# EAGLE design LoraWan_shield_v01 (EAGLE 7.5.0)

## Sheet 1 of 2
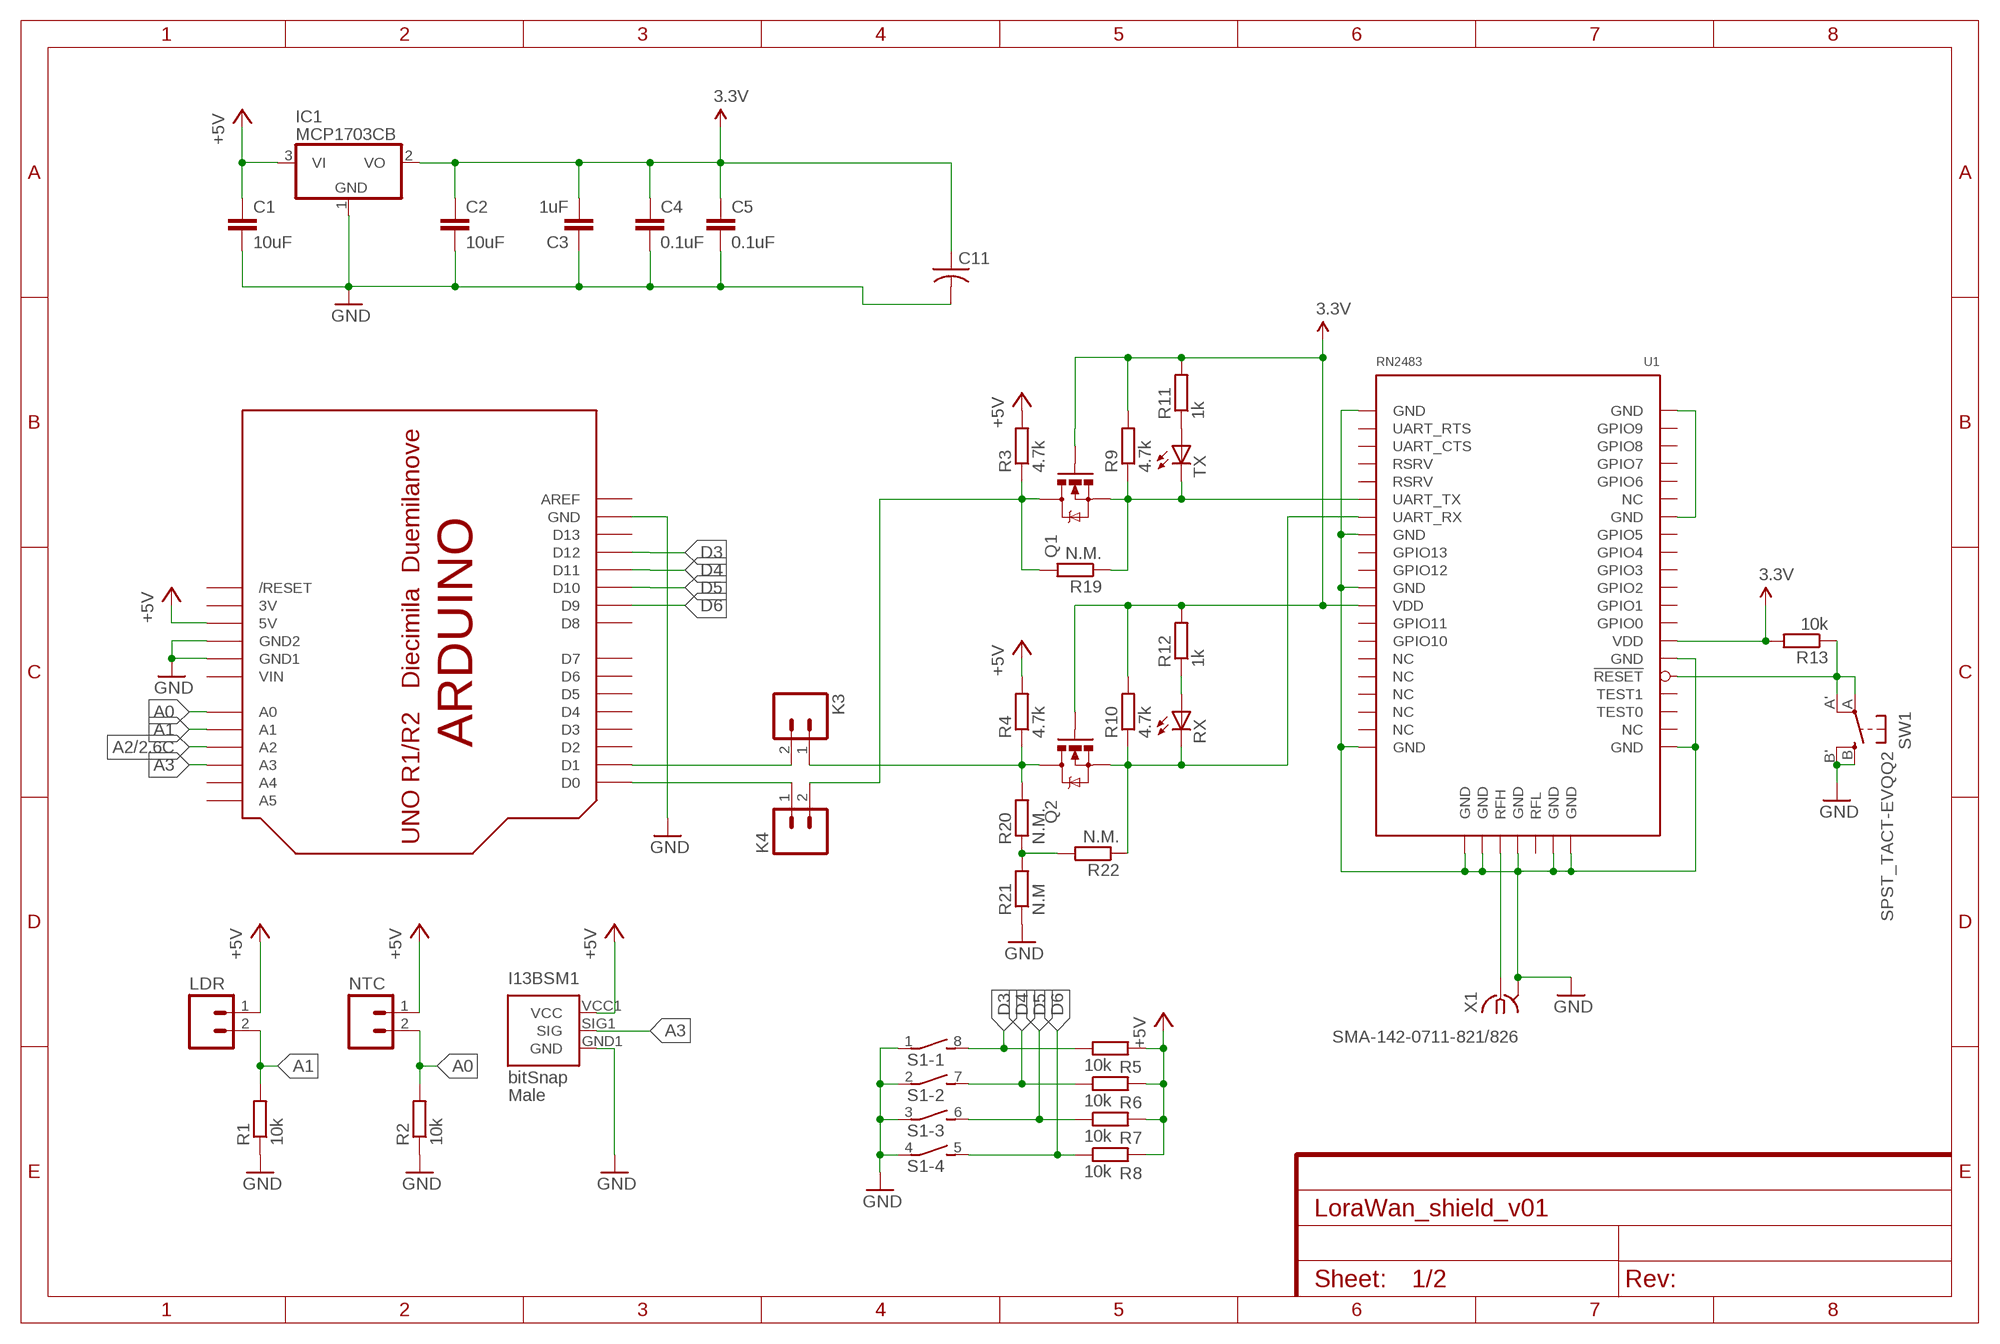
[diagram p0: schematic, sheet 1]

### Parts
ARD1  ARDUINO-NOHOLE  [ARDUINO-NOHOLE]
C1  10uF  C-EUC0603K  [C0603K]
C2  10uF  C-EUC0603K  [C0603K]
C3  1uF  C-EUC0603K  [C0603K]
C4  0.1uF  C-EUC0603K  [C0603K]
C5  0.1uF  C-EUC0603K  [C0603K]
C11  C-USC0603  [C0603]
I13BSM1  BITSNAP_V03_MALE  [BITSNAP_V03_MALE]
IC1  MCP1703CB  [SOT23]
K3  M02LOCK_LONGPADS  [1X02_LOCK_LONGPADS]
K4  M02LOCK_LONGPADS  [1X02_LOCK_LONGPADS]
LDR  M02LOCK_LONGPADS  [1X02_LOCK_LONGPADS]
NTC  M02LOCK_LONGPADS  [1X02_LOCK_LONGPADS]
Q1  DMG1012T  [SOT523]
Q2  DMG1012T  [SOT523]
R1  10k  R-EU_R0603  [R0603]
R2  10k  R-EU_R0603  [R0603]
R3  4.7k  R-EU_R0603  [R0603]
R4  4.7k  R-EU_R0603  [R0603]
R5  10k  R-EU_R0603  [R0603]
R6  10k  R-EU_R0603  [R0603]
R7  10k  R-EU_R0603  [R0603]
R8  10k  R-EU_R0603  [R0603]
R9  4.7k  R-EU_R0603  [R0603]
R10  4.7k  R-EU_R0603  [R0603]
R11  1k  R-EU_R0603  [R0603]
R12  1k  R-EU_R0603  [R0603]
R13  10k  R-EU_R0603  [R0603]
R19  N.M.  R-EU_R0603  [R0603]
R20  N.M.  R-EU_R0603  [R0603]
R21  N.M  R-EU_R0603  [R0603]
R22  N.M.  R-EU_R0603  [R0603]
RX  LEDCHIPLED_0603  [CHIPLED_0603]
S1  DIP04S  [DIP04S]
SW1  SPST_TACT-EVQQ2  [EVQ-Q2]
TX  LEDCHIPLED_0603  [CHIPLED_0603]
U1  RN2483  [RN2483]
X1  SMA-142-0711-821/826  [J502-ND-142-0711-821/826]

### Nets
3.3V: C2.1 C3.2 C4.1 C5.1 C11.1 IC1.2(VO) Q1.1(G) Q2.1(G) R9.2 R10.2 R11.2 R12.2 R13.2 U1.12(VDD) U1.34(VDD)
+5V: ARD1.5V C1.1 I13BSM1.VCC1(VCC) IC1.3(VI) LDR.1 NTC.1 R3.2 R4.2 R5.2 R6.2 R7.2 R8.2 ; also sheet 2
A0: ARD1.A0 NTC.2 R2.2
A1: ARD1.A1 LDR.2 R1.2
A2: ARD1.A2 ; also sheet 2
A3: ARD1.A3 I13BSM1.SIG1(SIG)
ARD_RX: ARD1.D1 K3.2
ARD_TX: ARD1.D0 K4.1
D3: ARD1.D12 R5.1 S1.8
D4: ARD1.D11 R6.1 S1.7
D5: ARD1.D10 R7.1 S1.6
D6: ARD1.D9 R8.1 S1.5
GND: ARD1.GND ARD1.GND1 ARD1.GND2 C1.2 C2.2 C3.1 C4.2 C5.2 C11.2 I13BSM1.GND1(GND) IC1.1(GND) R1.1 R2.1 R21.1 S1.1 S1.2 S1.3 S1.4 SW1.B'(S1) SW1.B(S) U1.1(GND) U1.8(GND) U1.11(GND) U1.20(GND) U1.21(GND) U1.22(GND) U1.24(GND) U1.26(GND) U1.27(GND) U1.28(GND) U1.33(GND) X1.G@1 X1.G@2 X1.G@3 X1.G@4 ; also sheet 2
N$1: U1.41(GND) U1.47(GND)
N$2: R13.1 SW1.A'(P1) SW1.A(P) U1.32(!RESET!)
N$3: Q1.2(S) R9.1 R19.1 TX.C U1.6(UART_TX)
N$4: K4.2 Q1.3(D) R3.1 R19.2
N$6: R11.1 TX.A
N$7: K3.1 Q2.3(D) R4.1 R20.2
N$8: R12.1 RX.A
N$9: U1.23(RFH) X1.1
N$10: Q2.2(S) R10.1 R22.1 RX.C U1.7(UART_RX)
N$11: R20.1 R21.2 R22.2
Unconnected: ARD1.A4 ARD1.A5 ARD1.AREF ARD1.D2 ARD1.D3 ARD1.D4 ARD1.D5 ARD1.D6 ARD1.D7 ARD1.D8 ARD1.D13 ARD1.RESET(/RESET) U1.2(UART_RTS) U1.3(UART_CTS) U1.4(RSRV) U1.5(RSRV) U1.9(GPIO13) U1.10(GPIO12) U1.13(GPIO11) U1.14(GPIO10) U1.15(NC) U1.16(NC) U1.17(NC) U1.18(NC) U1.19(NC) U1.25(RFL) U1.29(NC) U1.30(TEST0) U1.31(TEST1) U1.35(GPIO0) U1.36(GPIO1) U1.37(GPIO2) U1.38(GPIO3) U1.39(GPIO4) U1.40(GPIO5) U1.42(NC) U1.43(GPIO6) U1.44(GPIO7) U1.45(GPIO8) U1.46(GPIO9)

## Sheet 2 of 2: Electret Mic Amplifier
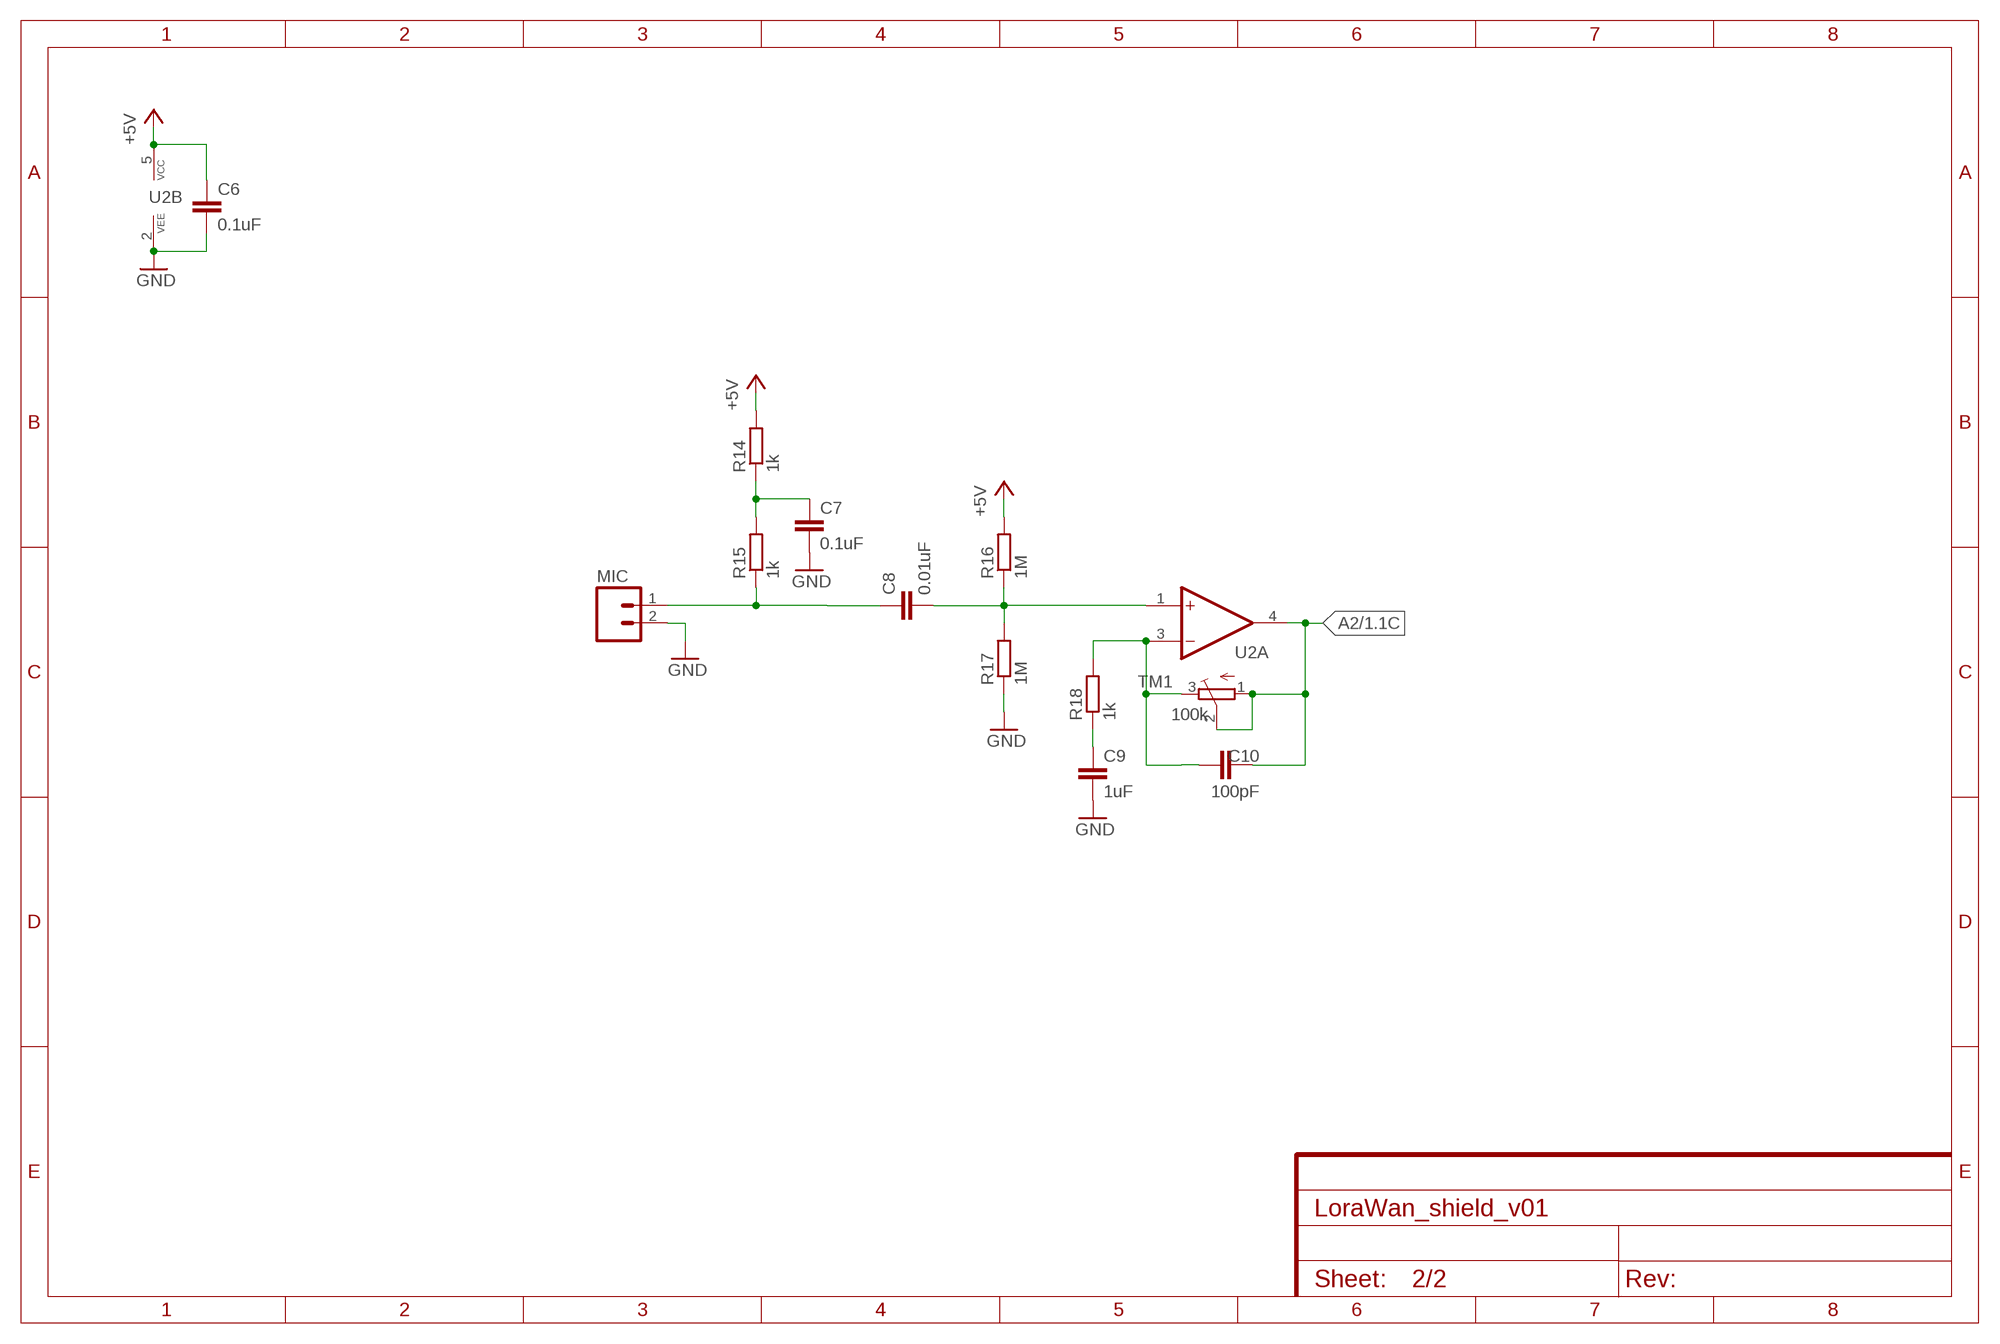
[diagram p1: schematic, sheet 2]

### Parts
C6  0.1uF  C-EUC0603K  [C0603K]
C7  0.1uF  C-EUC0603K  [C0603K]
C8  0.01uF  C-EUC0603K  [C0603K]
C9  1uF  C-EUC0603K  [C0603K]
C10  100pF  C-EUC0603K  [C0603K]
MIC  M02LOCK_LONGPADS  [1X02_LOCK_LONGPADS]
R14  1k  R-EU_R0603  [R0603]
R15  1k  R-EU_R0603  [R0603]
R16  1M  R-EU_R0603  [R0603]
R17  1M  R-EU_R0603  [R0603]
R18  1k  R-EU_R0603  [R0603]
TM1  100k  TRIMPOTTC33X  [TC33X]
U2  MAX4466EXK+T  [SC70]

### Nets
+5V: C6.1 R14.2 R16.2 U2.5(B:VCC) ; also sheet 1
A2: C10.2 TM1.1(A) TM1.2(S) U2.4(A:OUT) ; also sheet 1
GND: C6.2 C7.2 C9.2 MIC.2 R17.1 U2.2(B:VEE) ; also sheet 1
N$5: C8.1 MIC.1 R15.1
N$12: C7.1 R14.1 R15.2
N$13: C9.1 R18.1
N$15: C8.2 R16.1 R17.2 U2.1(A:+IN)
N$16: C10.1 R18.2 TM1.3(E) U2.3(A:-IN)

## Power pins joined to a net without a drawn wire
3V: ARD1.3V
VIN: ARD1.VIN

## Library data of the parts
ARD1 = adafruit:ARDUINO: Arduino Diecimila/Duemilanove Make a shield with ease, this package has all the named pins as well as the two mounting drill holes and an outline of the USB and DC power connector. The outline is on the DIMENSION layer, so if your board house uses it they will cut the outline to match. http://www.ladyada.net/library/pcb/eaglelibrary.html
C1-C10 = rcl:C-EU: CAPACITOR, European symbol
C11 = adafruit:C-US: CAPACITOR, American symbol
I13BSM1 = bitSnap:BITSNAP_V03_MALE
IC1 = simbits:MCP1703: 250 mA, 16V, Low Quiescent Current LDO Regulator Source: http://ww1.microchip.com/downloads/en/DeviceDoc/22049b.pdf
K3 K4 LDR MIC NTC = simbits:M02: Standard 2-pin 0.1" header. Use with - straight break away headers ( PRT-00116) - right angle break away headers (PRT-00553) - swiss pins (PRT-00743) - machine pins (PRT-00117) - female headers (PRT-00115) Molex polarized connector foot print use with: PRT-08233 with associated crimp pins and housings. 2.54_SCREWTERM for use with PRT-10571. 3.5mm Screw Terminal footprints for PRT-08084 5mm Screw Terminal footprints for use with PRT-08432
Q1 Q2 = simbits:DMG1012T
R1-R22 = rcl:R-EU_: RESISTOR, European symbol
RX TX = led:LED: LED OSRAM: - CHIPLED LG R971, LG N971, LY N971, LG Q971, LY Q971, LO R971, LY R971 LH N974, LH R974 LS Q976, LO Q976, LY Q976 LO Q996 - Hyper CHIPLED LW Q18S LB Q993, LB Q99A, LB R99A - SideLED LS A670, LO A670, LY A670, LG A670, LP A670 LB A673, LV A673, LT A673, LW A673 LH A674 LY A675 LS A676, LA A676, LO A676, LY A676, LW A676 LS A679, LY A679, LG A679 - Hyper Micro SIDELED® LS Y876, LA Y876, LO Y876, LY Y876 LT Y87S - SmartLED LW L88C, LW L88S LB L89C, LB L89S, LG L890 LS L89K, LO L89K, LY L89K LS L896, LA L896, LO L896, LY L896 - TOPLED LS T670, LO T670, LY T670, LG T670, LP T670 LSG T670, LSP T670, LSY T670, LOP T670, LYG T670 LG T671, LOG T671, LSG T671 LB T673, LV T673, LT T673, LW T673 LH T674 LS T676, LA T676, LO T676, LY T676, LB T676, LH T676, LSB T676, LW T676 LB T67C, LV T67C, LT T67C, LS T67K, LO T67K, LY T67K, LW E67C LS E67B, LA E67B, LO E67B, LY E67B, LB E67C, LV E67C, LT E67C LW T67C LS T679, LY T679, LG T679 LS T770, LO T770, LY T770, LG T770, LP T770 LB T773, LV T773, LT T773, LW T773 LH T774 LS E675, LA E675, LY E675, LS T675 LS T776, LA T776, LO T776, LY T776, LB T776 LHGB T686 LT T68C, LB T68C - Hyper Mini TOPLED® LB M676 - Mini TOPLED Santana® LG M470 LS M47K, LO M47K, LY M47K Source: http://www.osram.convergy.de LUXEON: - LUMILED® LXK2-PW12-R00, LXK2-PW12-S00, LXK2-PW14-U00, LXK2-PW14-V00 LXK2-PM12-R00, LXK2-PM12-S00, LXK2-PM14-U00 LXK2-PE12-Q00, LXK2-PE12-R00, LXK2-PE12-S00, LXK2-PE14-T00, LXK2-PE14-U00 LXK2-PB12-K00, LXK2-PB12-L00, LXK2-PB12-M00, LXK2-PB14-N00, LXK2-PB14-P00, LXK2-PB14-Q00 LXK2-PR12-L00, LXK2-PR12-M00, LXK2-PR14-Q00, LXK2-PR14-R00 LXK2-PD12-Q00, LXK2-PD12-R00, LXK2-PD12-S00 LXK2-PH12-R00, LXK2-PH12-S00 LXK2-PL12-P00, LXK2-PL12-Q00, LXK2-PL12-R00 Source: www.luxeon.com KINGBRIGHT: KA-3528ASYC Source: www.kingbright.com
S1 = switch-dil:DIP04S: DIL/CODE SWITCH; OC_FARNELL: 9471570; OC_NEWARK: unknown
SW1 = adafruit:SPST_TACT: SMT 6mm switch, EVQQ2 series http://www.ladyada.net/library/eagle
TM1 = adafruit:TRIMPOT: SMT trimmer potentiometer part number TC33X http://www.ladyada.net/library/eagle
U1 = simbits:RN2483: Microchip RN2483 Low-Power Long Range LoRa™ Technology Transceiver Module
U2 = simbits:MAX4466
X1 = con-coax:SMA-: SMA 50 Ohm End Launch Jack Receptacle - Round Contact Johnson Components Source: www.johnsoncomponents.com .. J502-ND.pdf; MF: JOHNSON COMPONENTS; MPN: 142-0711-821; OC_FARNELL: 1019328; OC_NEWARK: 16F3627

## Board
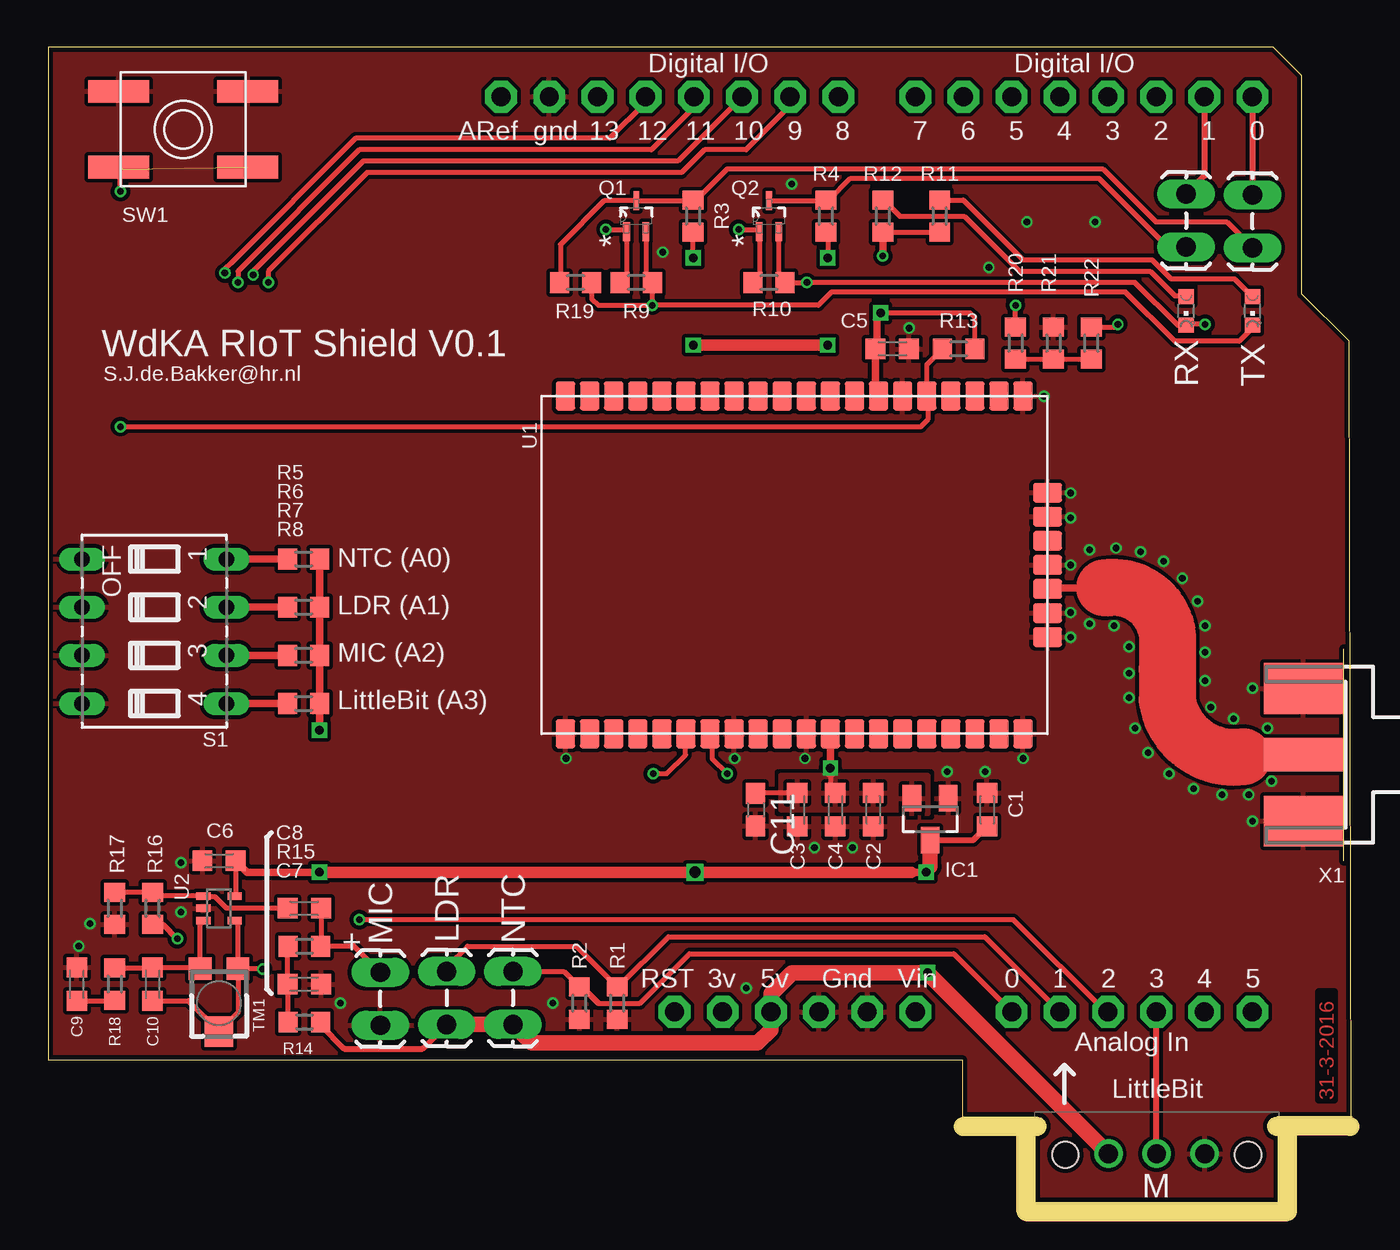
[diagram p2: board, top side]
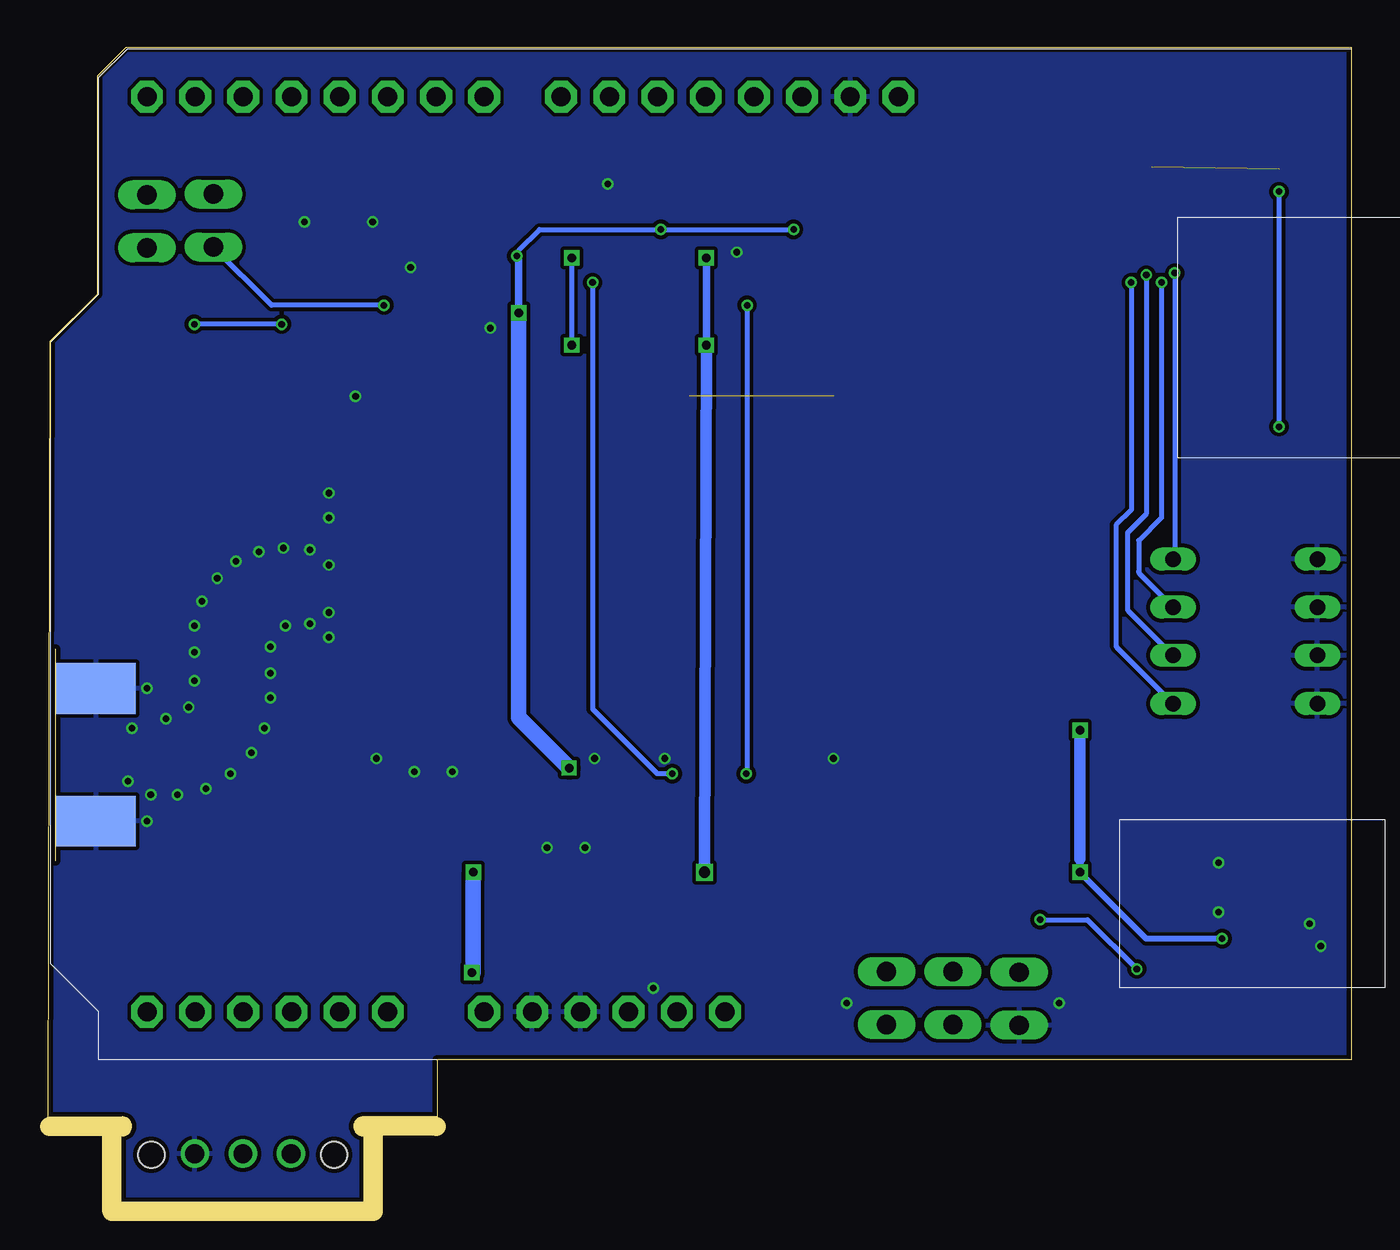
[diagram p3: board, bottom side, seen from below]

Size 68.75 x 60.9 mm. Coordinates in mm from the lower left corner, seen from the top.
Outline: 68.75,4.5 68.7,4.5
Outline: 68.7,4.5 65,4.5
Outline: 68.7,4.5 68.6,45.4 66.1,47.9 66.1,59.4 64.6,60.9 0,60.9 0,7.5 48.2,7.5 48.2,4.5 48.3,4.5
Copper layers (1*16): Top 0.018mm / dielectric 1.55mm / Bottom 0.018mm
Design rules "eC_2Layer_PClass6_BaseCopperO18_eCDefault *": minimum track width 0.15mm, minimum drill 0.35mm, track to track 0.15mm, track to pad 0.15mm, pad to pad 0.15mm, via to via 0.15mm, smd to smd 0mil, copper to edge 0.25mm, drill to drill 0.35mm, minimum pad ring 0.175mm, minimum via ring 0.125mm, stop-mask expansion 0mil, vias tented up to drill 0.45mm, thermal gap 0.2mm

### Footprints (pad centres in the part's own frame; a part is rotated, then mirrored left to right if it is on the bottom)
ARDUINO-NOHOLE = drill 1 pad 1.676 octagon: 3V 35.56,2.54; 5V 38.1,2.54; A0 50.8,2.54; A1 53.34,2.54; A2 55.88,2.54; A3 58.42,2.54; A4 60.96,2.54; A5 63.5,2.54; AREF 23.876,50.8; D0 63.5,50.8; D1 60.96,50.8; D2 58.42,50.8; D3 55.88,50.8; D4 53.34,50.8; D5 50.8,50.8; D6 48.26,50.8; D7 45.72,50.8; D8 41.656,50.8; D9 39.116,50.8; D10 36.576,50.8; D11 34.036,50.8; D12 31.496,50.8; D13 28.956,50.8; GND 26.416,50.8; GND1 43.18,2.54; GND2 40.64,2.54; RESET 33.02,2.54; VIN 45.72,2.54
C0603K = smd 1.05 x 1.08: 1 -0.875,0; 2 0.875,0
C0603 = smd 1.1 x 1: 1 -0.85,0; 2 0.85,0
BITSNAP_V03_MALE = drill 1: GND1 8.98,2.56; SIG1 6.44,2.56; VCC1 3.9,2.56 | hole 1.4: 11.27,2.5; 1.63,2.5
SOT23 = smd 1 x 1.4: 1 -0.95,-1.1; 2 0.95,-1.1; 3 0,1.1
1X02_LOCK_LONGPADS = drill 1.016 long: 1 -0.127,0; 2 2.667,0
SOT523 = smd 1.016 x 0.356: 1 -0.813,0.508; 2 -0.813,-0.508 | smd 1.016 x 0.305: 3 0.813,0
R0603 = smd 1 x 1.1: 1 -0.85,0; 2 0.85,0
CHIPLED_0603 = smd 0.8 x 0.8: A 0,-0.75; C 0,0.75
DIP04S = drill 0.813 long: 1 -3.81,-3.81; 2 -1.27,-3.81; 3 1.27,-3.81; 4 3.81,-3.81; 5 3.81,3.81; 6 1.27,3.81; 7 -1.27,3.81; 8 -3.81,3.81
EVQ-Q2 = smd 3.2 x 1.2: A -3.4,-2; A' 3.4,-2; B -3.4,2; B' 3.4,2
TC33X = smd 1.2 x 1.2: 1 -1,-1.825; 3 1,-1.825 | smd 1.5 x 1.6: 2 0,1.5
RN2483 = smd 1.524 x 1.015: 1 17.8,1.27; 2 17.8,2.54; 3 17.8,3.81; 4 17.8,5.08; 5 17.8,6.35; 6 17.8,7.62; 7 17.8,8.89; 8 17.8,10.16; 9 17.8,11.43; 10 17.8,12.7; 11 17.8,13.97; 12 17.8,15.24; 13 17.8,16.51; 14 17.8,17.78; 15 17.8,19.05; 16 17.8,20.32; 17 17.8,21.59; 18 17.8,22.86; 19 17.8,24.13; 20 17.8,25.4; 28 -0.02,25.4; 29 -0.02,24.13; 30 -0.02,22.86; 31 -0.02,21.59; 32 -0.02,20.32; 33 -0.02,19.05; 34 -0.02,17.78; 35 -0.02,16.51; 36 -0.02,15.24; 37 -0.02,13.97; 38 -0.02,12.7; 39 -0.02,11.43; 40 -0.02,10.16; 41 -0.02,8.89; 42 -0.02,7.62; 43 -0.02,6.35; 44 -0.02,5.08; 45 -0.02,3.81; 46 -0.02,2.54; 47 -0.02,1.27 | smd 1.015 x 1.524: 21 12.7,26.69; 22 11.43,26.69; 23 10.16,26.69; 24 8.89,26.69; 25 7.62,26.69; 26 6.35,26.69; 27 5.08,26.69
SC70 = smd 0.4 x 0.75: 1 -0.65,-0.825; 2 0,-0.825; 3 0.65,-0.825; 4 0.65,0.825; 5 -0.65,0.825
J502-ND-142-0711-821/826 = smd 4.191 x 1.778: 1 2.115,0 | smd 4.191 x 2.667: G@1 2.115,3.495; G@2 2.115,-3.495 | smd 4.191 x 2.667 bottom: G@3 2.115,3.495; G@4 2.115,-3.495

### Placement (x,y rotation side)
ARD1  0,7.5 0 top
C1  49.5,20.7 90 top
C2  43.5,20.7 270 top
C3  39.5,20.7 90 top
C4  41.5,20.7 270 top
C5  44.5,45 0 top
C6  9,18 180 top
C7  13.5,11.5 0 top
C8  13.5,15.5 180 top
C9  1.5,11.5 90 top
C10  5.5,11.5 270 top
C11  37.3,20.7 270 top
I13BSM1  52,0 0 top
IC1  46.5,20.2 180 top
K3  60,50.5 90 top
K4  63.5,53 270 top
LDR  21,9.5 90 top
MIC  17.5,12 270 top
NTC  24.5,9.5 90 top
Q1  31,52 90 top
Q2  38,52 90 top
R1  30,10.5 90 top
R2  28,10.5 90 top
R3  34,52 270 top
R4  41,52 270 top
R5  13.46,33.92 0 top
R6  13.46,31.38 0 top
R7  13.46,28.84 0 top
R8  13.46,26.3 0 top
R9  31,48.5 180 top
R10  38,48.5 180 top
R11  47,52 270 top
R12  44,52 270 top
R13  48,45 0 top
R14  13.5,9.5 0 top
R15  13.5,13.5 180 top
R16  5.5,15.5 270 top
R17  3.5,15.5 90 top
R18  3.5,11.5 90 top
R19  27.8,48.5 180 top
R20  51,45.3 90 top
R21  53,45.3 270 top
R22  55,45.3 270 top
RX  60,47 180 top
S1  5.59,30.11 270 top
SW1  7.11,56.58 0 top
TM1  9,10.5 180 top
TX  63.5,47 180 top
U1  26,42.5 270 top
U2  9,15.5 270 top
X1  68.3,23.6 180 top

### Tracks (layer width: path | path; a pad name or v marks a point on that pad's centre or on a via)
3.3V  (via drill 0.35 pad 0.6, 0.45 pad 0.81)
  Top 0.254: 41.24,22.8 41.24,21.84 C4.1 | R9.2 30.49,48.84 Q1.1 30.38,51.3 v29.4,51.3 | R10.2 37.49,48.84 Q2.1 37.38,51.3 v36.4,51.3 | 43.62,42.67 U1.34 | R13.2 48.85,46.65 48.6,46.9 v43.9,46.9 43.7,46.7 | 43.7,45.08 C5.1 | R12.2 R11.2 | C3.2 37.3,21.57 C11.1
  Top 0.406: U1.12 v41.24,22.9 | C5.1 43.62,42.67 | 43.7,46.7 43.7,45.08 | v44,49.9 R12.2
  Top 0.813: v41.24,22.9 41.24,22.8
  Bottom 0.254: 43.9,49.8 43.9,50.2 42.8,51.3 v36.4,51.3 v29.4,51.3
  Bottom 0.406: v43.9,46.9 43.9,49.8 v44,49.9
  Bottom 0.813: v43.9,46.9 43.9,25.56 v41.24,22.9
  pour Top: 46.4,20.5 46.4,22.5 38.6,22.5 38.6,20.7 44.8,20.7 45,20.5
+5V  (via drill 0.35 pad 0.6, 0.45 pad 0.81, 0.6 pad 0.61)
  Top 0.254: C6.1 9.88,16.2 | v34,49.8 R3.2 | R4.2 41.1,51.05 v41.1,49.8 | v41.1,45.2 41,45.2
  Top 0.305: ARD1.5V 38.1,9.9 | 14.5,9.5 R14.2 14.35,9.35 15.6,8.1 19.73,8.1 LDR.1 | IC1.3 48.77,19.1 C1.1 | 9.88,16.2 U2.5 | R16.2 6.05,14.65 v6.8,13.9
  Top 0.406: v14.3,24.9 14.31,25.21 R8.2 R7.2 R6.2 R5.2 | 45.5,17.4 v46.3,17.4 | C6.1 10.47,17.4 v14.3,17.4
  Top 0.61: v14.3,17.4 v34.1,17.4 | v34.1,17.4 34.8,17.4 | 34.8,17.4 45.5,17.4 | 41,45.2 v34,45.2 | v34.1,17.4 34.8,17.4
  Top 0.813: 38.1,9.9 ARD1.5V | ARD1.5V 38.1,11 39.2,12.1 45.6,12.1 v46.36,12.1 I13BSM1.VCC1 | ARD1.5V 38.1,9.1 37.4,8.4 25.47,8.4 NTC.1 LDR.1 | v46.3,17.4 46.3,17.5 46.5,17.7 IC1.3
  Bottom 0.254: v41.1,49.8 v41.1,45.2
  Bottom 0.305: v6.8,13.9 10.8,13.9 v14.3,17.4
  Bottom 0.406: 14.3,18.1 v14.3,17.4 | v34,45.2 v34,49.8
  Bottom 0.61: v14.3,24.9 14.3,18.1 | v34.1,17.4 34.1,18 v34,45.2
  Bottom 0.813: v46.36,12.1 46.3,12.1 v46.3,17.4
A0
  Top 0.254: NTC.2 27.18,12.17 R2.2 | 29,10.5 31.2,10.5 33.8,13.1 47.74,13.1 ARD1.A0
  Top 0.305: R2.2 28.15,11.35 29,10.5
A1
  Top 0.254: 21,12.4 22.1,13.5 27.85,13.5 R1.2 | 30.05,11.35 32.7,14 49.38,14 ARD1.A1
  Top 0.305: LDR.2 21,12.4 | R1.2 30.05,11.35
A2  (via drill 0.35 pad 0.6)
  Top 0.254: C10.2 7.38,10.62 TM1.2 10,10 TM1.1 10,14.68 | 55.76,10.04 50.9,14.9 v16.4,14.9 | v11.3,12.3 10.03,12.3
  Top 0.305: 10,14.68 U2.4 | ARD1.A2 55.76,10.04 | 10.03,12.3 TM1.1
  Bottom 0.254: v16.4,14.9 13.9,14.9 v11.3,12.3
A3
  Top 0.305: I13BSM1.SIG1 58.42,2.56 ARD1.A3
ARD_RX
  Top 0.305: ARD1.D1 60.96,54.13 K3.2
ARD_TX
  Top 0.305: ARD1.D0 K4.1
D3  (via drill 0.35 pad 0.6)
  Top 0.254: ARD1.D12 31.5,58 29.6,56.1 16.2,56.1 9.6,49.5 9.3,49.2 v9.3,49
  Top 0.406: S1.8 R5.1
  Bottom 0.254: v9.3,49 9.3,34.01 S1.8
D4  (via drill 0.35 pad 0.6)
  Top 0.254: ARD1.D11 34.04,57.74 31.8,55.5 16.4,55.5 10,49.1 v10,48.5
  Top 0.406: S1.7 R6.1
  Bottom 0.254: v10,48.5 10,36.1 11.2,34.9 11.2,33.28 arc-45 11.13,33.1 S1.7
D5  (via drill 0.35 pad 0.6)
  Top 0.254: ARD1.D10 36.58,58.28 33.2,54.9 16.6,54.9 10.8,49.1 v10.8,48.9
  Top 0.406: S1.6 R7.1
  Bottom 0.254: v10.8,48.9 10.8,36.3 11.8,35.3 11.8,31.34 arc-45 11.73,31.16 S1.6
D6  (via drill 0.35 pad 0.6)
  Top 0.254: ARD1.D9 39.12,57.82 36.8,55.5 34.6,55.5 33.4,54.3 16.8,54.3 11.6,49.1 v11.6,48.5
  Top 0.406: S1.5 R8.1
  Bottom 0.254: v11.6,48.5 11.6,36.5 12.4,35.7 12.4,29.4 arc-45 12.33,29.22 S1.5
GND  (via drill 0.35 pad 0.6)
  other vias: 45.4,46.1 52.5,42.5 53.9,37.4 53.9,36.1 53.9,33.6 53.9,31.1 53.9,29.8 51.4,23.4 39.9,23.4 36.2,23.4 27.3,23.4 49.4,22.7 47.4,22.7 42.4,18.7 40.4,18.7 7,15.3 7,17.9 1.6,13.5 2.2,14.7 15.4,10.5 26.6,10.5 36.8,11.3 39.2,53.7 32.4,50.1 49.6,49.3 51.6,51.7 55.2,51.7 54.9,34.4 56.3,34.5 57.6,34.3 58.8,33.8 59.8,32.9 60.6,31.7 61,30.4 61,29 61,27.5 61.3,26.1 63.3,21.5 62.5,25.5 61.9,21.5 60.4,21.8 59.1,22.6 58,23.7 57.3,25 57,26.6 57,27.9 57,29.3 56.2,30.4 54.9,30.5 64.3,25 64.5,22.2 63.5,27.1 63.5,20.1
  pour Top (isolate 0.203, rank 6): -0.6,61.3 68.8,61.1 68.8,-1.3 -1.2,-0.7 -1.6,61.3 -0.2,60.9
  pour Bottom (isolate 0.203, rank 6): -1.2,61.3 69.2,61.5 69.2,-0.9 -1.8,-0.7 -2.2,61.3 -0.8,60.9
N$1  (1 unrouted)
N$2  (via drill 0.35 pad 0.6)  (1 unrouted)
  Top 0.254: R13.1 46.32,44.17 U1.32 46.4,42.44 46.4,41.3 46,40.9 v3.8,40.9 | v3.8,53.3 3.8,54.49 SW1.A
  Bottom 0.254: v3.8,40.9 v3.8,53.3
N$3  (via drill 0.35 pad 0.6, 0.35 pad 0.61)
  Top 0.254: Q1.2 31.51,48.84 R9.1 v31.85,47.3 | TX.C 63.5,46.1 62.8,45.4 59.4,45.4 56.8,48 41.3,48 40.6,47.3 v31.85,47.3 | 33.6,24.72 U1.6 33.6,24.68 33.6,23.6 32.6,22.6 v31.9,22.6 | R19.1 28.65,47.65 29,47.3 v31.85,47.3
  Bottom 0.254: v31.85,47.3 31.85,23.75 31.85,22.65 v31.9,22.6
N$4
  Top 0.254: K4.2 62.13,51.7 58.4,51.7 55.6,54.5 35.8,54.5 34.15,52.85 R3.1 33.96,52.81 Q1.3 29.31,52.81 27,50.5 27,48.55 R19.2
N$5
  Top 0.254: C8.1 14.38,13.53 16.1,13.53 MIC.1
  Top 0.305: 14.38,13.53 R15.1
N$6
  Top 0.254: TX.A 62.55,48.7 59.2,48.7 58.2,49.7 51.4,49.7 48.25,52.85 R11.1
N$7  (via drill 0.35 pad 0.6)
  Top 0.254: Q2.3 40.96,52.81 R4.1 41.15,52.85 42.3,54 55.4,54 58.9,50.5 59.87,50.5 K3.1 | R20.2 v51,47.3
  Bottom 0.254: v51,47.3 56.93,47.3 K3.1
N$8
  Top 0.254: R12.1 44.05,52.85 44.9,52 48.3,52 51.2,49.1 58.1,49.1 59.4,47.8 59.95,47.8 RX.A
N$9
  Top 0.406: U1.23 52.75,32.4 55.7,32.4 | X1.1 63,23.5
  Top 3: 55.7,32.4 arc-90 59,30 59,28.1 59,26.5 arc90 63,23.5
N$10  (via drill 0.35 pad 0.6)
  Top 0.254: Q2.2 38.51,48.84 R10.1 v40,48.5 57.3,48.5 59.55,46.25 RX.C 60.05,46.3 v61,46.3 | U1.7 35,24.81 35,23.4 v35.8,22.6 | R22.1 56.35,46.15 v56.4,46.3
  Bottom 0.254: v56.4,46.3 v61,46.3 | v40,48.5 40,26 36.6,22.6 v35.8,22.6
N$11
  Top 0.254: R20.1 R21.2 R22.2
N$12
  Top 0.254: R14.1 12.65,11.47 | C7.1 12.62,13.47
  Top 0.305: 12.65,11.47 C7.1 | 12.62,13.47 R15.2
N$13
  Top 0.254: C9.1 3.48,10.62
  Top 0.305: 3.48,10.62 R18.1
N$15
  Top 0.254: 5.7,16.15 U2.1 8.22,16.1 8.8,16.1 9.4,15.5 C8.2 | R16.1 R17.2
  Top 0.305: 5.7,16.15 R16.1
N$16
  Top 0.254: TM1.3 8,14.68 | R18.2 5.47,12.35 | C10.1 7.95,12.38
  Top 0.305: 8,14.68 U2.3 | 5.47,12.35 C10.1 | 7.95,12.38 TM1.3

### Text on the board
Top: 31-3-2016
tPlace: WdKA RIoT Shield V0.1 | S.J.de.Bakker@hr.nl
tNames: NTC (A0) | LDR (A1) | MIC (A2) | LittleBit (A3) | + | LittleBit